# EAGLE design Geiger_Rev1 (EAGLE 9.6.2)
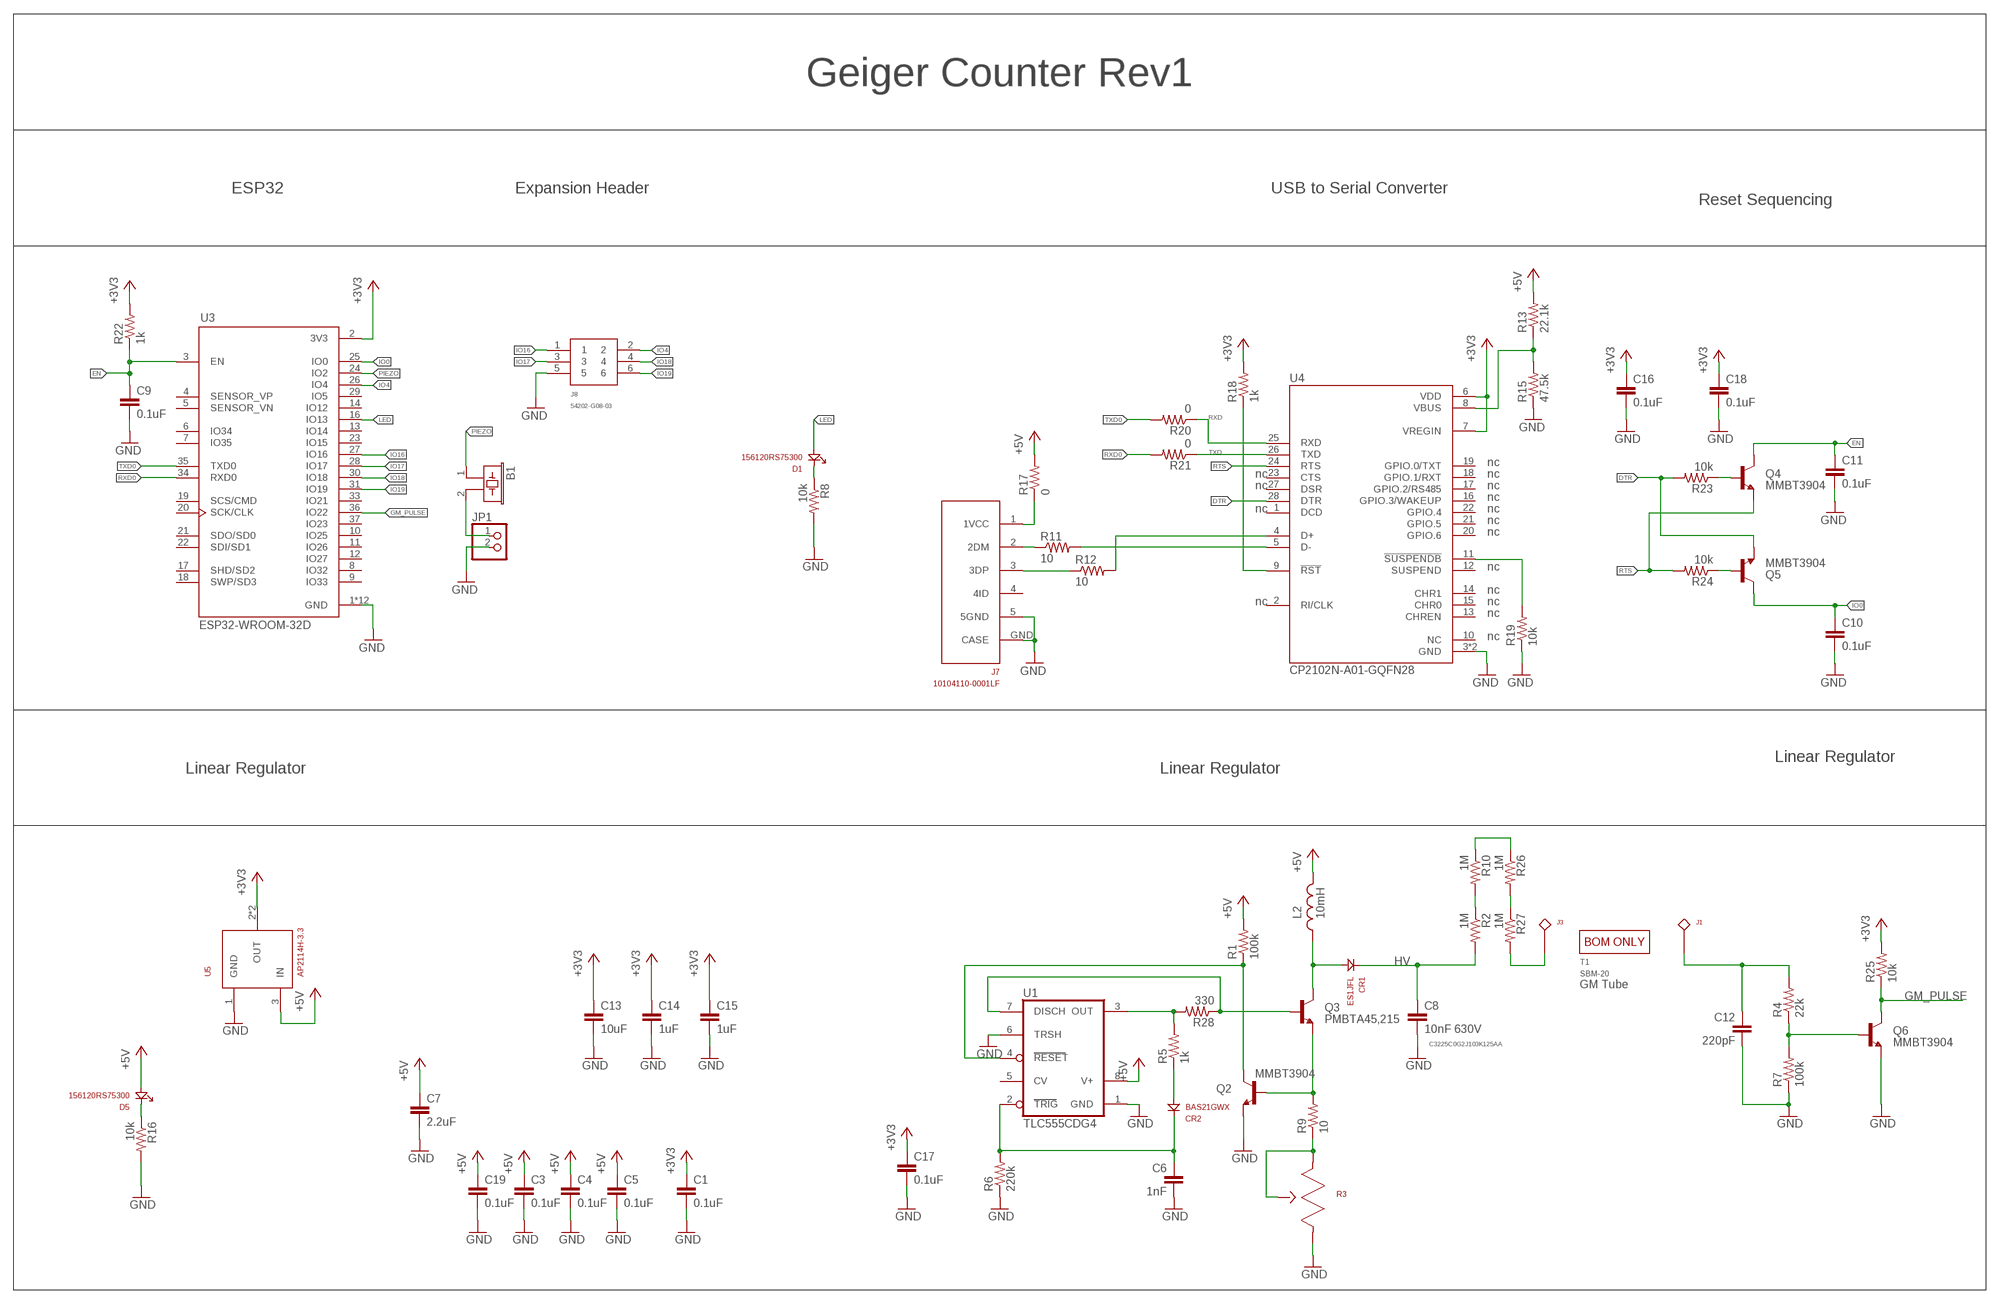
[diagram p0: schematic, sheet 1]

## Parts
B1  PIEZO17MM  [PS1740P02E]
C1  0.1uF  0603_CAPACITOR  [0603]
C3  0.1uF  0603_CAPACITOR  [0603]
C4  0.1uF  0603_CAPACITOR  [0603]
C5  0.1uF  0603_CAPACITOR  [0603]
C6  1nF  0603_CAPACITOR  [0603]
C7  2.2uF  1210_CAPACITOR  [1210]
C8  10nF 630V  1210_CAPACITOR  [1210]
C9  0.1uF  0603_CAPACITOR  [0603]
C10  0.1uF  0603_CAPACITOR  [0603]
C11  0.1uF  0603_CAPACITOR  [0603]
C12  220pF  0603_CAPACITOR  [0603]
C13  10uF  0805_CAPACITOR  [0805]
C14  1uF  0805_CAPACITOR  [0805]
C15  1uF  0805_CAPACITOR  [0805]
C16  0.1uF  0603_CAPACITOR  [0603]
C17  0.1uF  0603_CAPACITOR  [0603]
C18  0.1uF  0603_CAPACITOR  [0603]
C19  0.1uF  0603_CAPACITOR  [0603]
CR1  ES1JFL  [SOD123(AK)]
CR2  BAS21GWX  [SOD123]
D1  156120RS75300  [1206_REV]
D5  156120RS75300  [1206_REV]
J1  01010002Z  [01010002Z]
J3  01010002Z  [01010002Z]
J7  10104110-0001LF  [MICRO_USB]
J8  54202-G08-03  [6-SMT-HEADER]
JP1  PINHD-1X2  [1X02]
L2  10mH  SDR1005-103KL  [SDR1005]
Q2  MMBT3904  MMBT3904-TP  [SOT23-3]
Q3  PMBTA45,215  [SOT23-3]
Q4  MMBT3904  MMBT3904-TP  [SOT23-3]
Q5  MMBT3904  MMBT3904-TP  [SOT23-3]
Q6  MMBT3904  MMBT3904-TP  [SOT23-3]
R1  100k  0603_RESISTOR  [0603]
R2  1M  0603_RESISTOR  [0603]
R3  10  3361P-1-100GLF  [3361P]
R4  22k  0603_RESISTOR  [0603]
R5  1k  0603_RESISTOR  [0603]
R6  220k  0603_RESISTOR  [0603]
R7  100k  0603_RESISTOR  [0603]
R8  10k  0603_RESISTOR  [0603]
R9  10  1206_RESISTOR  [1206]
R10  1M  0603_RESISTOR  [0603]
R11  10  0603_RESISTOR  [0603]
R12  10  0603_RESISTOR  [0603]
R13  22.1k  0603_RESISTOR  [0603]
R15  47.5k  0603_RESISTOR  [0603]
R16  10k  0603_RESISTOR  [0603]
R17  0  0603_RESISTOR  [0603]
R18  1k  0603_RESISTOR  [0603]
R19  10k  0603_RESISTOR  [0603]
R20  0  0603_RESISTOR  [0603]
R21  0  0603_RESISTOR  [0603]
R22  1k  0603_RESISTOR  [0603]
R23  10k  0603_RESISTOR  [0603]
R24  10k  0603_RESISTOR  [0603]
R25  10k  0603_RESISTOR  [0603]
R26  1M  0603_RESISTOR  [0603]
R27  1M  0603_RESISTOR  [0603]
R28  330  0603_RESISTOR  [0603]
T1  SBM-20  [SBM-20]
U1  TLC555CDG4  [SOIC8]
U3  ESP32-WROOM-32D  [MODULE_ESP32-WROOM-32D]
U4  CP2102N-A01-GQFN28  [QFN50P500X500X80-29N]
U5  AP2114H-3.3  [SOT223]

## Nets
+3V3: C1.1 C13.1 C14.1 C15.1 C16.1 C17.1 C18.1 R18.2 R22.2 R25.2 U3.2(3V3) U4.6(VDD) U4.7(VREGIN) U5.2(OUT) U5.T(OUT)
+5V: C3.1 C4.1 C5.1 C7.1 C19.1 D5.A L2.P$2 R1.2 R13.2 R17.2 U1.8(V+) U5.3(IN)
DTR: Q5.2(E) R23.2 U4.28(DTR)
EN: C9.1 C11.1 Q4.3(C) R22.1 U3.3(EN)
GM_PULSE: Q6.3(C) R25.1 U3.36(IO22)
GND: C1.2 C3.2 C4.2 C5.2 C6.2 C7.2 C8.2 C9.2 C10.2 C11.2 C12.2 C13.2 C14.2 C15.2 C16.2 C17.2 C18.2 C19.2 J7.5(5GND) J7.GND(CASE) J8.5 JP1.2 Q2.2(E) Q6.2(E) R3.3 R6.1 R7.1 R8.2 R15.1 R16.2 R19.1 U1.1(GND) U1.6(TRSH) U3.1(GND) U3.15(GND) U3.38(GND) U3.39_1(GND) U3.39_2(GND) U3.39_3(GND) U3.39_4(GND) U3.39_5(GND) U3.39_6(GND) U3.39_7(GND) U3.39_8(GND) U3.39_9(GND) U4.3(GND) U4.29(GND) U5.1(GND)
HV [HV]: C8.1 CR1.K R2.2
IO0: C10.1 Q5.3(C) U3.25(IO0)
IO4: J8.2 U3.26(IO4)
IO16: J8.1 U3.27(IO16)
IO17: J8.3 U3.28(IO17)
IO18: J8.4 U3.30(IO18)
IO19: J8.6 U3.31(IO19)
LED: D1.A U3.16(IO13)
N$1: CR2.2(A) R5.1
N$2: J7.2(2DM) R11.1
N$3: Q2.3(C) R1.1 U1.4(RESET)
N$4: J7.3(3DP) R12.1
N$5: R11.2 U4.5(D-)
N$6: R12.2 U4.4(D+)
N$7: R13.1 R15.2 U4.8(VBUS)
N$8: Q3.1(B) R28.1 U1.7(DISCH)
N$9: C6.1 CR2.1(K) R6.2 U1.2(TRIG)
N$10: R5.2 R28.2 U1.3(OUT)
N$11: Q2.1(B) Q3.2(E) R9.2
N$12: B1.2 JP1.1
N$13: J7.1(1VCC) R17.1
N$14: Q6.1(B) R4.1 R7.2
N$15 [HV]: J3.P$1 R27.2
N$16 [HV]: R2.1 R10.2
N$17 [HV]: R10.1 R26.1
N$18: R18.1 U4.9(!RST)
N$19: D5.K R16.1
N$20: R19.2 U4.11(!SUSPENDB)
N$21 [HV]: R26.2 R27.1
N$22: Q4.1(B) R23.1
N$23: R3.1 R3.2 R9.1
N$24: Q5.1(B) R24.1
N$27: D1.K R8.1
N$39: C12.1 J1.P$1 R4.2
PIEZO: B1.1 U3.24(IO2)
RTS: Q4.2(E) R24.2 U4.24(RTS)
RXD: R20.1 U4.25(RXD)
RXD0: R21.2 U3.34(RXD0)
SW [HV]: CR1.A L2.P$1 Q3.3(C)
TXD: R21.1 U4.26(TXD)
TXD0: R20.2 U3.35(TXD0)
Unconnected: J7.4(4ID) U1.5(CV) U3.4(SENSOR_VP) U3.5(SENSOR_VN) U3.6(IO34) U3.7(IO35) U3.8(IO32) U3.9(IO33) U3.10(IO25) U3.11(IO26) U3.12(IO27) U3.13(IO14) U3.14(IO12) U3.17(SHD/SD2) U3.18(SWP/SD3) U3.19(SCS/CMD) U3.20(SCK/CLK) U3.21(SDO/SD0) U3.22(SDI/SD1) U3.23(IO15) U3.29(IO5) U3.33(IO21) U3.37(IO23) U4.1(DCD) U4.2(RI/CLK) U4.10(NC) U4.12(SUSPEND) U4.13(CHREN) U4.14(CHR1) U4.15(CHR0) U4.16(GPIO.3/WAKEUP) U4.17(GPIO.2/RS485) U4.18(GPIO.1/RXT) U4.19(GPIO.0/TXT) U4.20(GPIO.6) U4.21(GPIO.5) U4.22(GPIO.4) U4.23(CTS) U4.27(DSR)

## Notes on the sheet
- Geiger Counter Rev1
- ESP32 | Expansion Header | USB to Serial Converter
- Reset Sequencing
- nc
- nc | nc
- nc | nc
- nc
- nc | nc
- nc
- nc
- nc
- nc
- nc | nc
- nc
- nc
- Linear Regulator
- Linear Regulator | Linear Regulator
- GM Tube
- C3225C0G2J103K125AA

## Library data of the parts
B1 = mightyohm:PIEZO; OC_FARNELL: unknown; OC_NEWARK: unknown
C1 C3-C6 C9-C12 C16-C19 = ruark2:0603_CAPACITOR: 0603 Capacitor -- WARNING: NO DEFINED VALUE OR PART NUMBER; VALUE: sel
C7 C8 = ruark2:1210_CAPACITOR: NO VALUE
C13-C15 = ruark2:0805_CAPACITOR: NO DEFINED PN
CR1 = ruark2:ES1JFL: Diode Standard 600 V 1A Surface Mount SOD-123F; PARTNO: ES1JFLCT-ND
CR2 = ruark2:BAS21GWX: Diode Standard 200V 225mA (DC) Surface Mount SOD-123; PARTNO: 1727-7323-1-ND
D1 D5 = ruark2:156120RS75300: Red 624nm LED Indication - Discrete 2V 1206 Reverse Mount (3216 Metric); PARTNO: 732-5031-1-ND
J1 J3 = ruark2:01010002Z: SMD Fuse Clip 15 A 250V 1 Circuit Cartridge Chassis Mount; PARTNO: F4080-ND
J7 = ruark2:10104110-0001LF: USB - micro B USB 2.0 Receptacle Connector 5 Position Surface Mount, Right Angle; PARTNO: 609-4052-1-ND
J8 = ruark2:54202-G08-03: Connector Header Surface Mount 6 position 0.100" (2.54mm); PARTNO: 609-5602-ND
JP1 = pinhead:PINHD-1X2: PIN HEADER
L2 = ruark2:SDR1005-103KL: 10 mH Unshielded Wirewound Inductor 100 mA 39Ohm Max Nonstandard 100mA; PARTNO: SDR1005-103KLCT-ND
Q2 Q4-Q6 = ruark2:MMBT3904-TP: Bipolar (BJT) Transistor NPN 40V 200mA 300MHz 350mW Surface Mount SOT-23 (SMD 2N3904); PARTNO: MMBT3904TPMSCT-ND
Q3 = ruark2:PMBTA45,215: Bipolar (BJT) Transistor NPN 500 V 150 mA 35MHz 300 mW Surface Mount TO-236AB; PARTNO: 1727-5332-1-ND
R1 R2 R4-R8 R10-R13 R15-R28 = ruark2:0603_RESISTOR: 0603 Resistor -- WARNING: NO DEFINED PART NUMBER OR VALUE; VALUE: sel
R3 = ruark2:3361P-1-100GLF: 10 Ohms 0.5W, 1/2W Gull Wing Surface Mount Trimmer Potentiometer Cermet 1.0 Turn Top Adjustment; PARTNO: 3361P-1-100GLFCT-ND
R9 = ruark2:1206_RESISTOR: NO DEFINED PN; VALUE: sel
T1 = ruark2:SBM-20: SBM-20 Part Outline. Does not include connectors (fuse clips)
U1 = ruark2:TLC555CDG4: 555 Type, Timer/Oscillator (Single) IC 2.1MHz 8-SOIC; PARTNO: 296-52992-ND
U3 = ESP32-WROOM-32D:ESP32-WROOM-32D: Bluetooth, WiFi 802.11b/g/n, Bluetooth v4.2 + EDR, Class 1, 2 and 3 Transceiver Module 2.4GHz ~ 2.5GHz Integrated, Trace Surface Mount Check prices <https://pricing.snapeda.com/parts/ESP32-WROOM-32D/Espressif%20Systems/view-part?ref=eda>; AVAILABILITY: Bad; DESCRIPTION: Bluetooth, WiFi 802.11b/g/n, Bluetooth v4.2 +EDR, Class 1, 2 and 3 Transceiver Module 2.4GHz ~ 2.5GHz Integrated, Trace Surface Mount; MF: Espressif Systems; MP: ESP32-WROOM-32D; PACKAGE: Module Espressif Systems; PRICE: None
U4 = CP2102N-A01-GQFN28:CP2102N-A01-GQFN28: USB Bridge, USB to UART USB 2.0 UART Interface 28-QFN (5x5) Check availability <https://pricing.snapeda.com/parts/CP2102N-A01-GQFN28/Silicon%20Labs/view-part?ref=eda>; AVAILABILITY: In Stock; DESCRIPTION: USB Bridge, USB to UART USB 2.0 UART Interface 28-QFN (5x5); MF: Silicon Labs; MP: CP2102N-A01-GQFN28; PACKAGE: WFQFN-28 Silicon Labs; PRICE: None
U5 = ruark2:AP2114H-3.3: Linear Voltage Regulator IC Positive Fixed 1 Output 3.3V 1A SOT-223; PARTNO: AP2114H-3.3TRG1DICT-ND

## Net classes
1 HV: clearance 1.27 mm

## Board
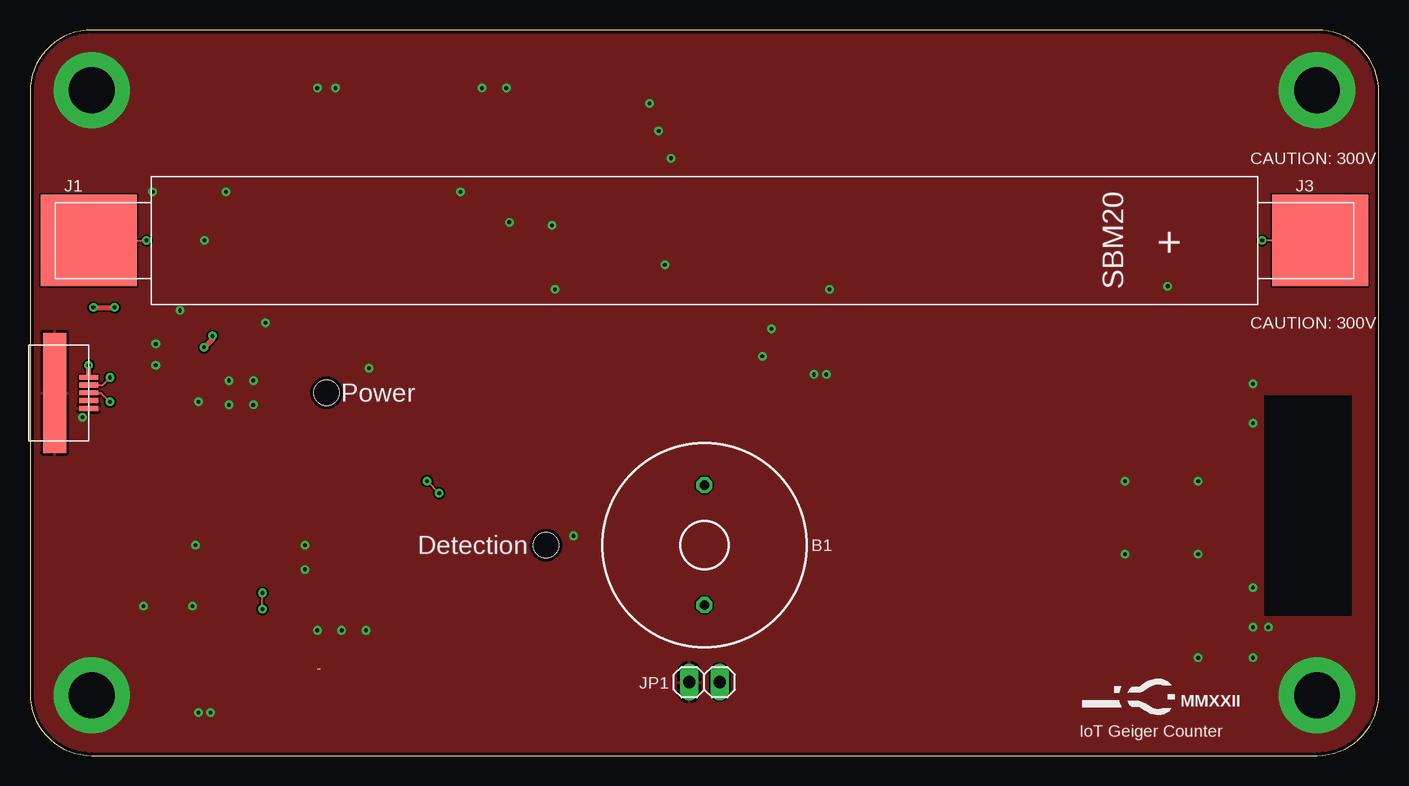
[diagram p1: board, top side]
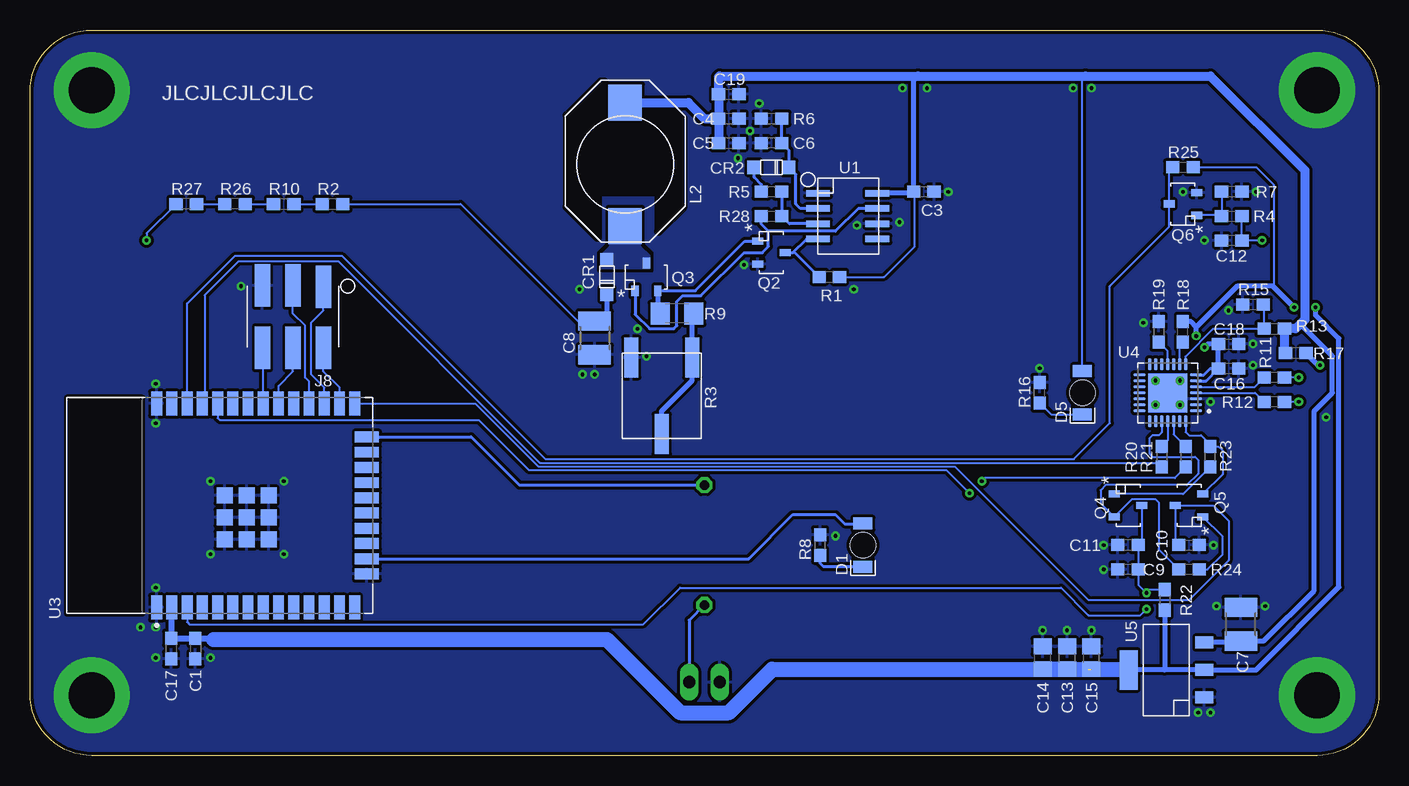
[diagram p2: board, bottom side, seen from below]

Size 112.4 x 60.5 mm. Coordinates in mm from the lower left corner, seen from the top.
Outline: 0,55.35 0,5.15 arc90 5.15,0 107.25,0 arc90 112.4,5.15 112.4,55.35 arc90 107.25,60.5 5.15,60.5 arc90 0,55.35
Copper layers (1*16): Top 0.035mm / dielectric 1.5mm / Bottom 0.035mm
Design rules "default *": minimum track width 6mil, minimum drill 12mil, track to track 6mil, track to pad 6mil, pad to pad 6mil, via to via 6mil, smd to smd 6mil, copper to edge 0.3mm, drill to drill 6mil, minimum pad ring 10mil, minimum via ring 8mil, stop-mask expansion 4mil, vias tented up to drill 12mil, thermal gap 10mil
tRestrict: area 102.9,11.7 to 110,30
bRestrict: area 58,43.2 to 67.6,56.2

### Footprints (pad centres in the part's own frame; a part is rotated, then mirrored left to right if it is on the bottom)
PS1740P02E = drill 0.813 octagon: 1 -5,0; 2 5,0
0603 = smd 1.1 x 1: 1 -0.85,0; 2 0.85,0
1210 = smd 1.6 x 2.7: 1 -1.4,0; 2 1.4,0
0805 = smd 1.3 x 1.5: 1 -0.95,0; 2 0.95,0
SOD123(AK) = smd 1.1 x 1.1: A 1.45,0; K -1.45,0
SOD123 = smd 1.1 x 1.1: 1 -1.45,0; 2 1.45,0
1206_REV = smd 1 x 1.6: A -1.8,0; K 1.8,0 | hole 2.1: 0,0
01010002Z = smd 8.001 x 7.62: P$1 0,0
MICRO_USB = smd 0.4 x 1.6: 1 -1.3,0; 2 -0.65,0; 3 0,0; 4 0.65,0; 5 1.3,0 | smd 10 x 1.9: GND 0,-2.84
6-SMT-HEADER = smd 1.27 x 3.556: 1 -2.54,-2.477; 2 -2.54,2.603; 3 0,-2.603; 4 0,2.603; 5 2.54,-2.603; 6 2.54,2.603
1X02 = drill 1.016 long: 1 -1.27,0; 2 1.27,0
SDR1005 = smd 3 x 2.8: P$1 -5.15,0; P$2 5.15,0
SOT23-3 = smd 0.6 x 0.9: 1 0.32,-1.15; 2 2.22,-1.15; 3 1.27,1.15
3361P = smd 1.194 x 3.302: 1 -2.54,-3.188; 2 0,3.188; 3 2.54,-3.188
1206 = smd 1.6 x 1.8: 1 -1.4,0; 2 1.4,0
SOIC8 = smd 1.981 x 0.533: 1 -2.477,1.905; 2 -2.477,0.635; 3 -2.477,-0.635; 4 -2.477,-1.905; 5 2.477,-1.905; 6 2.477,-0.635; 7 2.477,0.635; 8 2.477,1.905
MODULE_ESP32-WROOM-32D = smd 2 x 0.9: 1 -8.5,5.26; 2 -8.5,3.99; 3 -8.5,2.72; 4 -8.5,1.45; 5 -8.5,0.18; 6 -8.5,-1.09; 7 -8.5,-2.36; 8 -8.5,-3.63; 9 -8.5,-4.9; 10 -8.5,-6.17; 11 -8.5,-7.44; 12 -8.5,-8.71; 13 -8.5,-9.98; 14 -8.5,-11.25; 25 8.5,-11.25; 26 8.5,-9.98; 27 8.5,-8.71; 28 8.5,-7.44; 29 8.5,-6.17; 30 8.5,-4.9; 31 8.5,-3.63; 32 8.5,-2.36; 33 8.5,-1.09; 34 8.5,0.18; 35 8.5,1.45; 36 8.5,2.72; 37 8.5,3.99; 38 8.5,5.26 | smd 0.9 x 2: 15 -5.715,-12.25; 16 -4.445,-12.25; 17 -3.175,-12.25; 18 -1.905,-12.25; 19 -0.635,-12.25; 20 0.635,-12.25; 21 1.905,-12.25; 22 3.175,-12.25; 23 4.445,-12.25; 24 5.715,-12.25 | smd 1.33 x 1.33: 39_1 -2.835,-0.405; 39_2 -1,-0.405; 39_3 0.835,-0.405; 39_4 -2.835,-2.24; 39_5 -1,-2.24; 39_6 0.835,-2.24; 39_7 -2.835,-4.075; 39_8 -1,-4.075; 39_9 0.835,-4.075
QFN50P500X500X80-29N = smd 1.01 x 0.27: 1 -2.36,1.5; 2 -2.36,1; 3 -2.36,0.5; 4 -2.36,0; 5 -2.36,-0.5; 6 -2.36,-1; 7 -2.36,-1.5; 15 2.36,-1.5; 16 2.36,-1; 17 2.36,-0.5; 18 2.36,0; 19 2.36,0.5; 20 2.36,1; 21 2.36,1.5 | smd 0.27 x 1.01: 8 -1.5,-2.36; 9 -1,-2.36; 10 -0.5,-2.36; 11 0,-2.36; 12 0.5,-2.36; 13 1,-2.36; 14 1.5,-2.36; 22 1.5,2.36; 23 1,2.36; 24 0.5,2.36; 25 0,2.36; 26 -0.5,2.36; 27 -1,2.36; 28 -1.5,2.36 | smd 3.25 x 3.25: 29 0,0
SOT223 = smd 0.991 x 1.499: 1 -2.286,0; 2 0,0; 3 2.286,0 | smd 3.277 x 1.499: T 0,6.299

### Placement (x,y rotation side)
B1  56.2,17.55 270 top
C1  98.62,8.91 270 bottom
C3  37.91,47.01 0 bottom
C4  54.17,53.11 0 bottom
C5  54.17,51.08 0 bottom
C6  50.61,51.08 180 bottom
C7  11.5,10.95 90 bottom
C8  65.34,34.82 270 bottom
C9  20.89,15.52 180 bottom
C10  15.81,17.55 0 bottom
C11  20.89,17.55 180 bottom
C12  12.26,42.95 180 bottom
C13  25.97,8.15 90 bottom
C14  28.01,8.15 90 bottom
C15  23.94,8.15 90 bottom
C16  12.51,32.28 0 bottom
C17  100.65,8.91 270 bottom
C18  12.51,34.31 0 bottom
C19  54.17,55.14 0 bottom
CR1  64.33,39.9 90 bottom
CR2  50.61,49.05 180 bottom
D1  42.99,17.55 270 bottom
D5  24.7,30.25 270 bottom
J1  4.89,42.95 0 top
J3  107.51,42.95 0 top
J7  4.89,30.25 270 top
J8  90.49,36.6 180 bottom
JP1  56.2,6.12 180 top
L2  62.8,49.3 90 bottom
Q2  50.61,43.2 270 bottom
Q3  62.3,39.9 0 bottom
Q4  20.89,22.12 270 bottom
Q5  15.81,19.58 90 bottom
Q6  16.32,44.73 90 bottom
R1  45.79,39.9 0 bottom
R2  87.19,46 0 bottom
R3  59.76,30 180 bottom
R4  12.26,44.98 0 bottom
R5  50.61,47.01 0 bottom
R6  50.61,53.11 0 bottom
R7  12.26,47.01 180 bottom
R8  46.55,17.55 90 bottom
R9  58.49,36.85 180 bottom
R10  91.25,46 0 bottom
R11  8.7,31.52 180 bottom
R12  8.7,29.49 180 bottom
R13  8.7,35.58 0 bottom
R15  10.48,37.62 0 bottom
R16  28.26,30.25 90 bottom
R17  6.92,33.55 180 bottom
R18  16.32,35.33 90 bottom
R19  18.35,35.33 270 bottom
R20  18.1,24.92 270 bottom
R21  16.07,24.92 270 bottom
R22  17.85,12.98 270 bottom
R23  14.04,24.92 90 bottom
R24  15.81,15.52 180 bottom
R25  16.32,49.05 0 bottom
R26  95.32,46 180 bottom
R27  99.38,46 180 bottom
R28  50.61,44.98 0 bottom
T1  56.2,42.95 0 top
U1  44.26,44.98 0 bottom
U3  96.59,20.85 90 bottom
U4  17.59,30.25 180 bottom
U5  14.54,7.14 90 bottom

### Tracks (layer width: path | path; a pad name or v marks a point on that pad's centre or on a via)
+3V3  (via drill 0.3)  (1 unrouted)
  Top 0.406: v14.51,34.03 15.21,34.73 v15.21,34.98 | v5.27,37.36 v7.05,37.36
  Bottom 0.152: R25.2 10.23,49.05 8.77,47.59 8.77,39.08
  Bottom 0.254: U4.6 14.39,31.25 C16.1 14.04,32.28 14.57,31.75 U4.7
  Bottom 0.406: C16.1 C18.1 14.23,34.31 v14.51,34.03 | v15.21,34.98 15.21,35.74 | R18.2 15.65,36.18 15.21,35.74 | v5.27,37.36 5.27,36.73 3.32,34.77 3.32,14.05 10.23,7.14 U5.2 17.85,7.14 | v7.05,37.36 8.77,39.08 8.83,39.14 11.81,39.14 15.21,35.74 | 17.85,7.14 U5.T | R22.2 17.85,7.14
  Bottom 0.508: U3.2 100.65,12.28 C17.1 C1.1 97.18,9.76 97.09,9.68
  Bottom 1.27: 97.09,9.68 64.33,9.68 58.23,3.58 54.17,3.58 50.55,7.2 C14.1 | C14.1 C13.1 | U5.T 20.91,7.2 24.2,7.2 C13.1 | C13.1 C14.1
+5V
  Bottom 0.152: R1.2 41.21,39.9 38.67,42.44 38.67,46.93 C3.1 | D5.A 24.7,56.41 24.45,56.67
  Bottom 0.406: 38.42,56.67 38.76,56.32 C3.1 38.89,46.89 U1.8 | 6.54,35.97 3.88,33.3 3.88,30.25 5.4,28.73 5.4,13.74 9.59,9.55 C7.1 11.62,9.42 U5.3
  Bottom 0.762: C4.1 C19.1 55.02,56.58 54.93,56.67 38.42,56.67 24.45,56.67 14.04,56.67 6.16,48.79 6.16,36.35 6.54,35.97 6.92,35.58 R13.2 7.85,33.63 arc-90 R17.2 | C4.1 C5.1 | L2.P$2 57.54,54.45 56.2,53.11 C4.1
DTR
  Bottom 0.152: U4.28 16.09,26.97 15.81,26.69 14.8,26.69 14.04,25.93 R23.2 13.36,25.77 13.02,25.42 13.02,23.45 Q5.2
EN  (via drill 0.3)
  Top 0.152: v19.37,12.22 v19.37,13.56
  Bottom 0.152: Q4.3 19.74,17.85 C11.1 C9.1 20.04,14.24 v19.37,13.56 19.1,13.83 R22.1 | U3.3 99.31,11.13 99.13,10.95 61.28,10.95 58.23,13.99 26.48,13.99 24.2,11.71 19.88,11.71 v19.37,12.22
GM_PULSE
  Bottom 0.152: R25.1 17.47,48.75 Q6.3 17.47,44.09 22.42,39.14 22.42,27.71 25.42,24.71 69.46,24.71 86.43,41.68 95.32,41.68 99.31,37.69 U3.36
GND  (via drill 0.3, 3.81 pad 6.35)
  Bottom 0.406: U4.29 v18.61,29.23
  other vias: 5.15,55.48 5.15,5.02 107.25,55.48 107.25,5.02 13.78,17.55 52.9,40.92 39.94,44.47 35.88,47.01 52.39,52.09 51.63,54.38 53.41,49.81 66.36,31.77 65.34,31.77 61.79,35.58 61.03,33.3 16.32,47.01 10.23,47.01 14.54,42.95 18.61,31.27 16.58,29.23 16.58,31.27 14.04,29.49 10.48,34.31 10.48,32.54 94.81,39.14 22.93,17.55 22.93,15.52 28.26,32.28 45.28,18.31 12.51,37.11 101.92,31.01 101.92,27.71 97.35,16.79 91.25,16.79 91.25,22.88 97.35,22.88 101.92,13.99 101.92,10.69 103.19,10.69 101.92,8.15 97.35,8.15 4.38,28.22 19.62,36.09 43.5,44.22 43.75,38.89 25.47,55.65 37.66,55.65 39.69,55.65 23.94,55.65 66.61,38.89 28.01,10.44 25.97,10.44 23.94,10.44 15.05,3.58 14.04,3.58 9.46,12.47 13.53,12.47
  pour Top: 0.2,54.25 0.2,55.1 arc-90 5.35,60.25 107.05,60.25 arc-90 112.2,55.1 112.2,5.4 arc-90 107.05,0.25 5.35,0.25 arc-90 0.2,5.4
  pour Bottom (isolate 0.254, rank 4): 0.2,54.25 0.2,55.1 arc-90 5.35,60.25 107.05,60.25 arc-90 112.2,55.1 112.2,5.4 arc-90 107.05,0.25 5.35,0.25 arc-90 0.2,5.4
  pour Bottom: 109.84,33.45 109.84,36.04 111.06,36.04 111.06,19.43 109.84,19.43
HV
  Bottom 0.152: C8.1 66.74,36.22 76.52,46 R2.2
  Bottom 0.406: CR1.K 64.33,36.09 64.46,36.22 C8.1
IO0
  Bottom 0.152: C10.1 16.96,17.85 Q5.3 13.78,20.85 12.51,19.58 12.51,16.28 15.81,12.98 24.2,12.98 35.32,24.1 70.04,24.1 75.29,29.35 U3.25
IO4
  Bottom 0.152: U3.26 86.61,30.68 87.95,32.03 J8.2
IO16
  Bottom 0.152: U3.27 87.88,30.68 88.97,31.77 88.97,36.09 87.95,37.11 J8.1
IO17
  Bottom 0.152: U3.28 89.15,31.19 89.47,31.52 89.47,35.84 90.49,36.85 J8.3
IO18
  Bottom 0.152: U3.30 91.69,30.83 90.49,32.03 J8.4
IO19
  Bottom 0.152: U3.31 92.96,33.92 J8.6
LED
  Bottom 0.254: U3.16 52.52,16.41 48.83,20.09 45.28,20.09 44.52,19.33 43.01,19.33 D1.A
N$1
  Bottom 0.254: R5.1 51.46,47.61 52.06,48.21 CR2.2
N$2  (via drill 0.3)
  Top 0.152: J7.2 6.05,30.9 v6.67,31.52
  Bottom 0.152: v6.67,31.52 R11.1
N$3
  Bottom 0.254: 46.87,42.95 U1.4 47.69,43.08 48.83,41.93 | Q2.3 49.09,41.93 48.83,41.93 | R1.1 48.67,41.93 48.83,41.93
N$4  (via drill 0.3)
  Top 0.152: J7.3 5.91,30.25 v6.67,29.49
  Bottom 0.152: v6.67,29.49 R12.1
N$5
  Bottom 0.152: U4.5 10.32,30.75 R11.2
N$6
  Bottom 0.152: U4.4 10.31,30.25 R12.2
N$7
  Bottom 0.152: U4.8 16.09,33.27 13.78,35.58 R13.1 9.55,37.54 R15.2
N$8
  Bottom 0.254: U1.7 43.37,45.62 45.28,43.71 50.87,43.71 | R28.1 51.46,44.31 50.87,43.71 | Q3.1 61.98,36.79 60.77,35.58 58.74,35.58 58.49,35.84 58.49,37.87 58.01,38.35 56.49,38.35 52.9,41.93 51.37,41.93 50.87,42.44 50.87,43.71
N$9
  Bottom 0.254: U1.2 48.2,45.62 48.58,46 48.58,48.46 CR2.1 49.16,50.48 C6.1 R6.2
N$10
  Bottom 0.254: U1.3 49.13,44.35 R28.2 R5.2
N$11
  Bottom 0.254: Q3.2 56.96,38.75 52.83,42.88 Q2.1
  Bottom 0.406: Q3.2 60.08,37.04 R9.2
N$12
  Bottom 0.254: B1.2 57.47,11.28 JP1.1
N$13  (via drill 0.3)
  Top 0.406: J7.1 v4.89,32.54
  Bottom 0.406: R17.1 5.06,32.54 v4.89,32.54
N$14
  Bottom 0.152: R7.2 R4.1 13.17,45.05 Q6.1
N$15  (via drill 0.3)
  Top 0.152: J3.P$1 v102.68,42.95
  Bottom 0.152: R27.2 102.68,43.55 v102.68,42.95
N$16
  Bottom 0.152: R10.2 R2.1
N$17
  Bottom 0.152: R26.1 R10.1
N$18
  Bottom 0.152: U4.9 16.59,34.21 R18.1
N$19
  Bottom 0.152: R16.1 27.31,28.45 D5.K
N$20
  Bottom 0.152: U4.11 17.59,33.72 R19.2
N$21
  Bottom 0.152: R27.1 R26.2
N$22
  Bottom 0.152: R23.1 16.3,21.8 Q4.1
N$23
  Bottom 0.406: R9.1 57.22,36.72 R3.1 57.22,31.27 59.76,28.73 R3.2
N$24
  Bottom 0.152: R24.1 14.29,15.52 13.02,16.79 13.02,18.26 Q5.1
N$27
  Bottom 0.254: D1.K 46.27,15.75 46.55,16.03 R8.1
N$39  (via drill 0.3)
  Top 0.152: J1.P$1 v9.72,42.95
  Bottom 0.152: v9.72,42.95 C12.1 R4.2
PIEZO
  Bottom 0.254: U3.24 75.63,26.57 71.61,22.55 B1.1
RTS
  Bottom 0.152: U4.24 18.09,26.96 18.35,26.69 18.86,26.69 19.12,26.44 19.12,25.17 18.86,24.92 15.31,24.92 15.05,24.66 15.05,23.48 15.99,22.55 22.75,22.55 23.18,22.12 23.18,21.04 Q4.2 20.57,21.38 18.63,21.38 18.35,21.11 18.35,17.21 R24.2
RXD
  Bottom 0.152: U4.25 17.59,26.27 R20.1
RXD0  (via drill 0.3)
  Top 0.152: v33.09,22.88 v34.1,21.87
  Bottom 0.152: U3.34 96.77,28.14 96.59,27.96 75,27.96 70.83,23.8 36.03,23.8 v34.1,21.87 | R21.2 17,23.14 32.83,23.14 v33.09,22.88
SW
  pour Bottom (no thermals): 64.84,40.92 64.84,40.66 60.77,40.66 60.77,41.68 61.53,42.44 61.53,42.7 61.53,45.49 64.07,45.49 64.07,42.44 64.84,41.68
TXD
  Bottom 0.152: U4.26 17.09,26.79 R21.1
TXD0
  Bottom 0.152: U3.35 98.04,29.23 97.86,29.41 97.86,38.38 95.02,41.21 86.72,41.21 69.92,24.41 18.44,24.41 R20.2 arc90 18.27,23.9

### Text on the board
tPlace: CAUTION: 300V | CAUTION: 300V | MMXXII | IoT Geiger Counter
tNames: Power | Detection
bNames: JLCJLCJLCJLC
tStop: 015